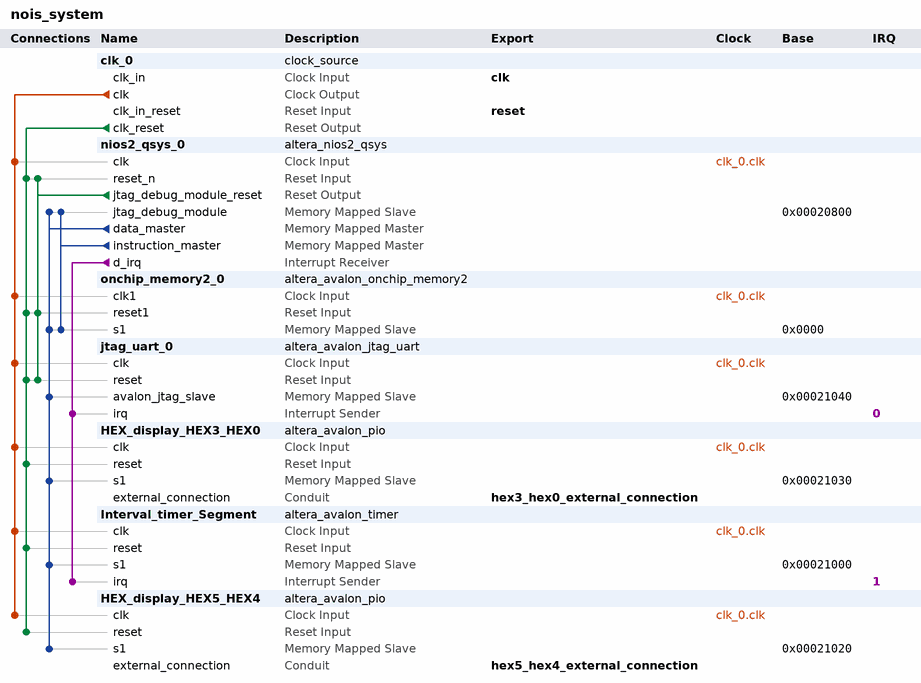
[diagram p0: system contents]
# Platform Designer (Qsys) system nois_system, Cyclone V 5CSEMA5F31C6
# Parameters at their usual value, and those the tool derives, are not listed.
package require -exact qsys 18.1
create_system nois_system
set_project_property DEVICE_FAMILY {Cyclone V}
set_project_property DEVICE 5CSEMA5F31C6

add_instance clk_0 clock_source 18.1
set_instance_parameter_value clk_0 clockFrequency 50000000

add_instance nios2_qsys_0 altera_nios2_qsys 16.1
set_instance_parameter_value nios2_qsys_0 breakSlave nios2_qsys_0.jtag_debug_module
set_instance_parameter_value nios2_qsys_0 exceptionSlave onchip_memory2_0.s1
set_instance_parameter_value nios2_qsys_0 icache_size 4096
set_instance_parameter_value nios2_qsys_0 impl Tiny
set_instance_parameter_value nios2_qsys_0 mmu_TLBMissExcSlave None
set_instance_parameter_value nios2_qsys_0 resetSlave onchip_memory2_0.s1
set_instance_parameter_value nios2_qsys_0 resetrequest_enabled true

add_instance onchip_memory2_0 altera_avalon_onchip_memory2 18.1
set_instance_parameter_value onchip_memory2_0 dataWidth 32
set_instance_parameter_value onchip_memory2_0 dualPort false
set_instance_parameter_value onchip_memory2_0 initMemContent true
set_instance_parameter_value onchip_memory2_0 initializationFileName onchip_mem.hex
set_instance_parameter_value onchip_memory2_0 memorySize 128000

add_instance jtag_uart_0 altera_avalon_jtag_uart 18.1
set_instance_parameter_value jtag_uart_0 simInteractiveOptions NO_INTERACTIVE_WINDOWS

add_instance HEX_display_HEX3_HEX0 altera_avalon_pio 18.1
set_instance_parameter_value HEX_display_HEX3_HEX0 direction Output
set_instance_parameter_value HEX_display_HEX3_HEX0 width 32

add_instance Interval_timer_Segment altera_avalon_timer 18.1
set_instance_parameter_value Interval_timer_Segment period 1
set_instance_parameter_value Interval_timer_Segment periodUnits MSEC

add_instance HEX_display_HEX5_HEX4 altera_avalon_pio 18.1
set_instance_parameter_value HEX_display_HEX5_HEX4 direction Output
set_instance_parameter_value HEX_display_HEX5_HEX4 width 16

# connections
add_connection clk_0.clk HEX_display_HEX3_HEX0.clk clock
add_connection clk_0.clk HEX_display_HEX5_HEX4.clk clock
add_connection clk_0.clk Interval_timer_Segment.clk clock
add_connection clk_0.clk jtag_uart_0.clk clock
add_connection clk_0.clk nios2_qsys_0.clk clock
add_connection clk_0.clk onchip_memory2_0.clk1 clock
add_connection clk_0.clk_reset HEX_display_HEX3_HEX0.reset reset
add_connection clk_0.clk_reset HEX_display_HEX5_HEX4.reset reset
add_connection clk_0.clk_reset Interval_timer_Segment.reset reset
add_connection clk_0.clk_reset jtag_uart_0.reset reset
add_connection clk_0.clk_reset nios2_qsys_0.reset_n reset
add_connection clk_0.clk_reset onchip_memory2_0.reset1 reset
add_connection nios2_qsys_0.jtag_debug_module_reset jtag_uart_0.reset reset
add_connection nios2_qsys_0.jtag_debug_module_reset nios2_qsys_0.reset_n reset
add_connection nios2_qsys_0.jtag_debug_module_reset onchip_memory2_0.reset1 reset
add_connection nios2_qsys_0.data_master HEX_display_HEX3_HEX0.s1 avalon
set_connection_parameter_value nios2_qsys_0.data_master/HEX_display_HEX3_HEX0.s1 baseAddress 0x00021030
add_connection nios2_qsys_0.data_master HEX_display_HEX5_HEX4.s1 avalon
set_connection_parameter_value nios2_qsys_0.data_master/HEX_display_HEX5_HEX4.s1 baseAddress 0x00021020
add_connection nios2_qsys_0.data_master Interval_timer_Segment.s1 avalon
set_connection_parameter_value nios2_qsys_0.data_master/Interval_timer_Segment.s1 baseAddress 0x00021000
add_connection nios2_qsys_0.data_master jtag_uart_0.avalon_jtag_slave avalon
set_connection_parameter_value nios2_qsys_0.data_master/jtag_uart_0.avalon_jtag_slave baseAddress 0x00021040
add_connection nios2_qsys_0.data_master nios2_qsys_0.jtag_debug_module avalon
set_connection_parameter_value nios2_qsys_0.data_master/nios2_qsys_0.jtag_debug_module baseAddress 0x00020800
add_connection nios2_qsys_0.data_master onchip_memory2_0.s1 avalon
set_connection_parameter_value nios2_qsys_0.data_master/onchip_memory2_0.s1 baseAddress 0x0000
add_connection nios2_qsys_0.instruction_master nios2_qsys_0.jtag_debug_module avalon
set_connection_parameter_value nios2_qsys_0.instruction_master/nios2_qsys_0.jtag_debug_module baseAddress 0x00020800
add_connection nios2_qsys_0.instruction_master onchip_memory2_0.s1 avalon
set_connection_parameter_value nios2_qsys_0.instruction_master/onchip_memory2_0.s1 baseAddress 0x0000
add_connection nios2_qsys_0.d_irq Interval_timer_Segment.irq interrupt
set_connection_parameter_value nios2_qsys_0.d_irq/Interval_timer_Segment.irq irqNumber 1
add_connection nios2_qsys_0.d_irq jtag_uart_0.irq interrupt
set_connection_parameter_value nios2_qsys_0.d_irq/jtag_uart_0.irq irqNumber 0

# exported interfaces
add_interface clk clock sink
set_interface_property clk EXPORT_OF clk_0.clk_in
add_interface hex3_hex0_external_connection conduit end
set_interface_property hex3_hex0_external_connection EXPORT_OF HEX_display_HEX3_HEX0.external_connection
add_interface hex5_hex4_external_connection conduit end
set_interface_property hex5_hex4_external_connection EXPORT_OF HEX_display_HEX5_HEX4.external_connection
add_interface reset reset sink
set_interface_property reset EXPORT_OF clk_0.clk_in_reset

set_interconnect_requirement {$system} qsys_mm.clockCrossingAdapter HANDSHAKE
set_interconnect_requirement {$system} qsys_mm.enableEccProtection FALSE
set_interconnect_requirement {$system} qsys_mm.insertDefaultSlave FALSE
set_interconnect_requirement {$system} qsys_mm.maxAdditionalLatency 1

save_system nois_system.qsys
